# Altium schematic sheet Illustrations 2.SchDoc: Illustrations 2
size A4; ApprovedBy: LD Stanton; Author: LD Stanton; CompanyName: University of Cape Town; DrawnBy: Lawrence Stanton; Engineer: Lawrence Stanton; Organization: University of Cape Town; Address1: Department of Electrical Engineering; Address2: Rondebosch; Address3: Cape Town; Address4: South Africa 7701; DocumentNumber: 3; SheetNumber: 4; SheetTotal: 4
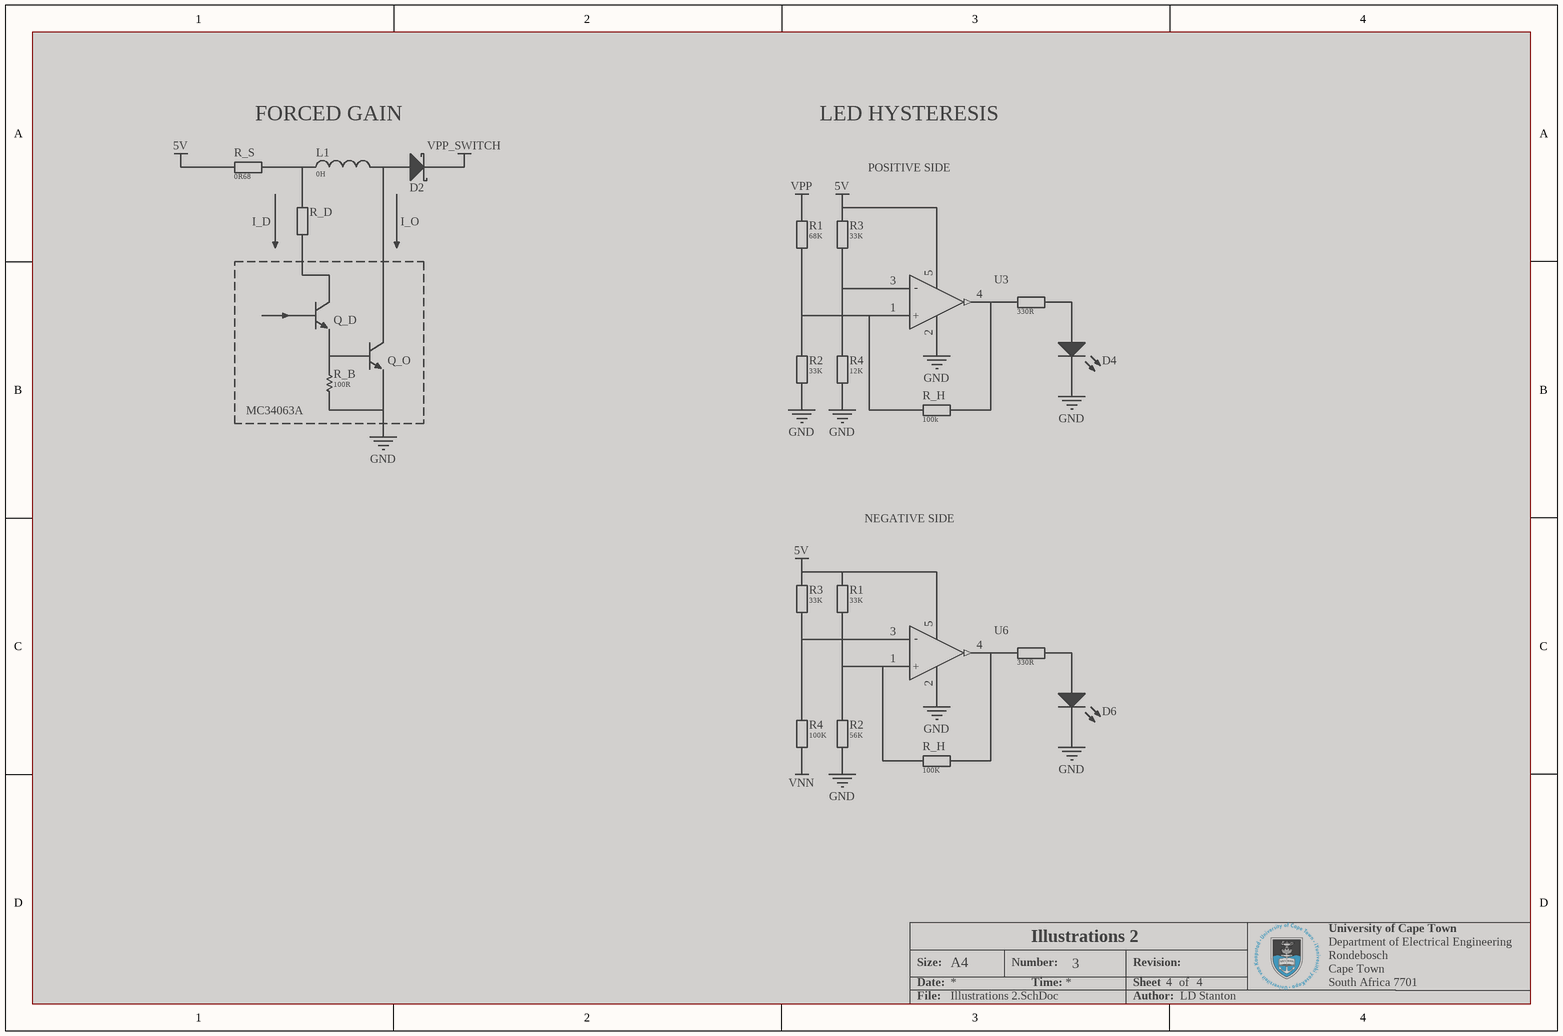
[diagram p0: Illustrations 2.SchDoc]

## Parts
(Parts that share a designator on the sheet are numbered #1, #2 ... from top to bottom, then left to right.)
D2  Schottky Diode Illustration  (value not drawn)  (graphical)  (masked out: inside a compile mask, not in the netlist)
D4  LED Illustration  (value not drawn)  (graphical)  (masked out: inside a compile mask, not in the netlist)
D6  LED Illustration  (value not drawn)  (graphical)  (masked out: inside a compile mask, not in the netlist)
L1  value 0H  (hidden comment: Inductor Illustration)  (graphical)  (masked out: inside a compile mask, not in the netlist)
Q_D  BJT NPN Illustration  (value not drawn)  (graphical)  (masked out: inside a compile mask, not in the netlist)
Q_O  BJT NPN Illustration  (value not drawn)  (graphical)  (masked out: inside a compile mask, not in the netlist)
R1#1  value 68K  (hidden comment: Resistor Box Illustration)  (graphical)  (masked out: inside a compile mask, not in the netlist)
R1#2  value 33K  (hidden comment: Resistor Box Illustration)  (graphical)  (masked out: inside a compile mask, not in the netlist)
R2#1  value 33K  (hidden comment: Resistor Box Illustration)  (graphical)  (masked out: inside a compile mask, not in the netlist)
R2#2  value 56K  (hidden comment: Resistor Box Illustration)  (graphical)  (masked out: inside a compile mask, not in the netlist)
R3#1  value 33K  (hidden comment: Resistor Box Illustration)  (graphical)  (masked out: inside a compile mask, not in the netlist)
R3#2  value 33K  (hidden comment: Resistor Box Illustration)  (graphical)  (masked out: inside a compile mask, not in the netlist)
R4#1  value 12K  (hidden comment: Resistor Box Illustration)  (graphical)  (masked out: inside a compile mask, not in the netlist)
R4#2  value 100K  (hidden comment: Resistor Box Illustration)  (graphical)  (masked out: inside a compile mask, not in the netlist)
R?#1  value 330R  (hidden comment: Resistor Box Illustration)  (graphical)  (masked out: inside a compile mask, not in the netlist)
R?#2  value 330R  (hidden comment: Resistor Box Illustration)  (graphical)  (masked out: inside a compile mask, not in the netlist)
R_B  value 100R  (hidden comment: Resistor Wire Illustration)  (graphical)  (masked out: inside a compile mask, not in the netlist)
R_D  Resistor Box Illustration  (value not drawn)  (graphical)  (masked out: inside a compile mask, not in the netlist)
R_H#1  value 100k  (hidden comment: Resistor Box Illustration)  (graphical)  (masked out: inside a compile mask, not in the netlist)
R_H#2  value 100K  (hidden comment: Resistor Box Illustration)  (graphical)  (masked out: inside a compile mask, not in the netlist)
R_S  value 0R68  (hidden comment: Resistor Box Illustration)  (graphical)  (masked out: inside a compile mask, not in the netlist)
U3  Op-Amp Powered Illustration  (value not drawn)  (graphical)  (masked out: inside a compile mask, not in the netlist)
U6  Op-Amp Powered Illustration  (value not drawn)  (graphical)  (masked out: inside a compile mask, not in the netlist)

## Blocks framed on the sheet
MC34063A: Q_D Q_O R_B

## Notes on the sheet
- FORCED GAIN
- LED HYSTERESIS
- POSITIVE SIDE
- I_D
- I_O
- NEGATIVE SIDE
- Size:
- Date:
- A4
- Number:
- Time:
- Revision:
- Sheet
- of
- File:
- Author:
- (in symbol CMP-000012-2) -; +

## Library data of the parts
D2 = CMP-00003-4: Schottky Diode for Ilustration; Blocking Voltage: 0V0; Forward Current: 0A0; Placement: CRITICAL; Temperature: -0 - 0°C; Forward Voltage: 0V0
D4 D6 = CMP-00004-3: LED for Ilustration; Colour: Red; Forward Voltage: 0V0; Placement: CRITICAL; Forward Current: 0A0; Temperature: -0 - 0°C
L1 = CMP-000009-4: General Inductor for Illustration; Rated Current: 0A; Tolerance: ±0%; Temperature Coefficient: ±0ppm/K; Placement: CRITICAL; Resistance: 0K0; Temperature: -0 - 0°C; Saturation Current: 0A
Q_D Q_O = CMP-000010-2: NPN Bipolar Junction Transistor for Illustration; Collector Current: 0A; Power: 0W; Collector-Emitter Voltage: 0V; Placement: CRITICAL; Saturation Voltgae: 0V; Temperature: -0 - 0°C
R1#1 R1#2 R2#1 R2#2 R3#1 R3#2 R4#1 R4#2 R?#1 R?#2 R_H#1 R_H#2 R_S = CMP-010-000360-14: Resistor for Illustration. Box Symbol.; Working Voltage: 0V; Power: 0W; Placement: CRITICAL; Tolerance: ±0%; Temperature Coefficient: ±0ppm/K; Package: 0000; Temperature: -0 - 0°C
R_B = CMP-010-000361-6: Resistor for Illustration. Wire Symbol.; Temperature Coefficient: ±0ppm/K; Placement: CRITICAL; Power: 0W; Tolerance: ±0%; Working Voltage: 0V; Temperature: -0 - 0°C; Package: 0000
R_D = CMP-010-000360-14: Resistor for Illustration. Box Symbol.; Value: 0K0; Working Voltage: 0V; Power: 0W; Placement: CRITICAL; Tolerance: ±0%; Temperature Coefficient: ±0ppm/K; Package: 0000; Temperature: -0 - 0°C
U3 U6 = CMP-000012-2: Operational Amplifier with Power Pins for Illustration; Placement: CRITICAL; Temperature: -0 - 0°C